# EAGLE design 224_distance (EAGLE 9.6.2)
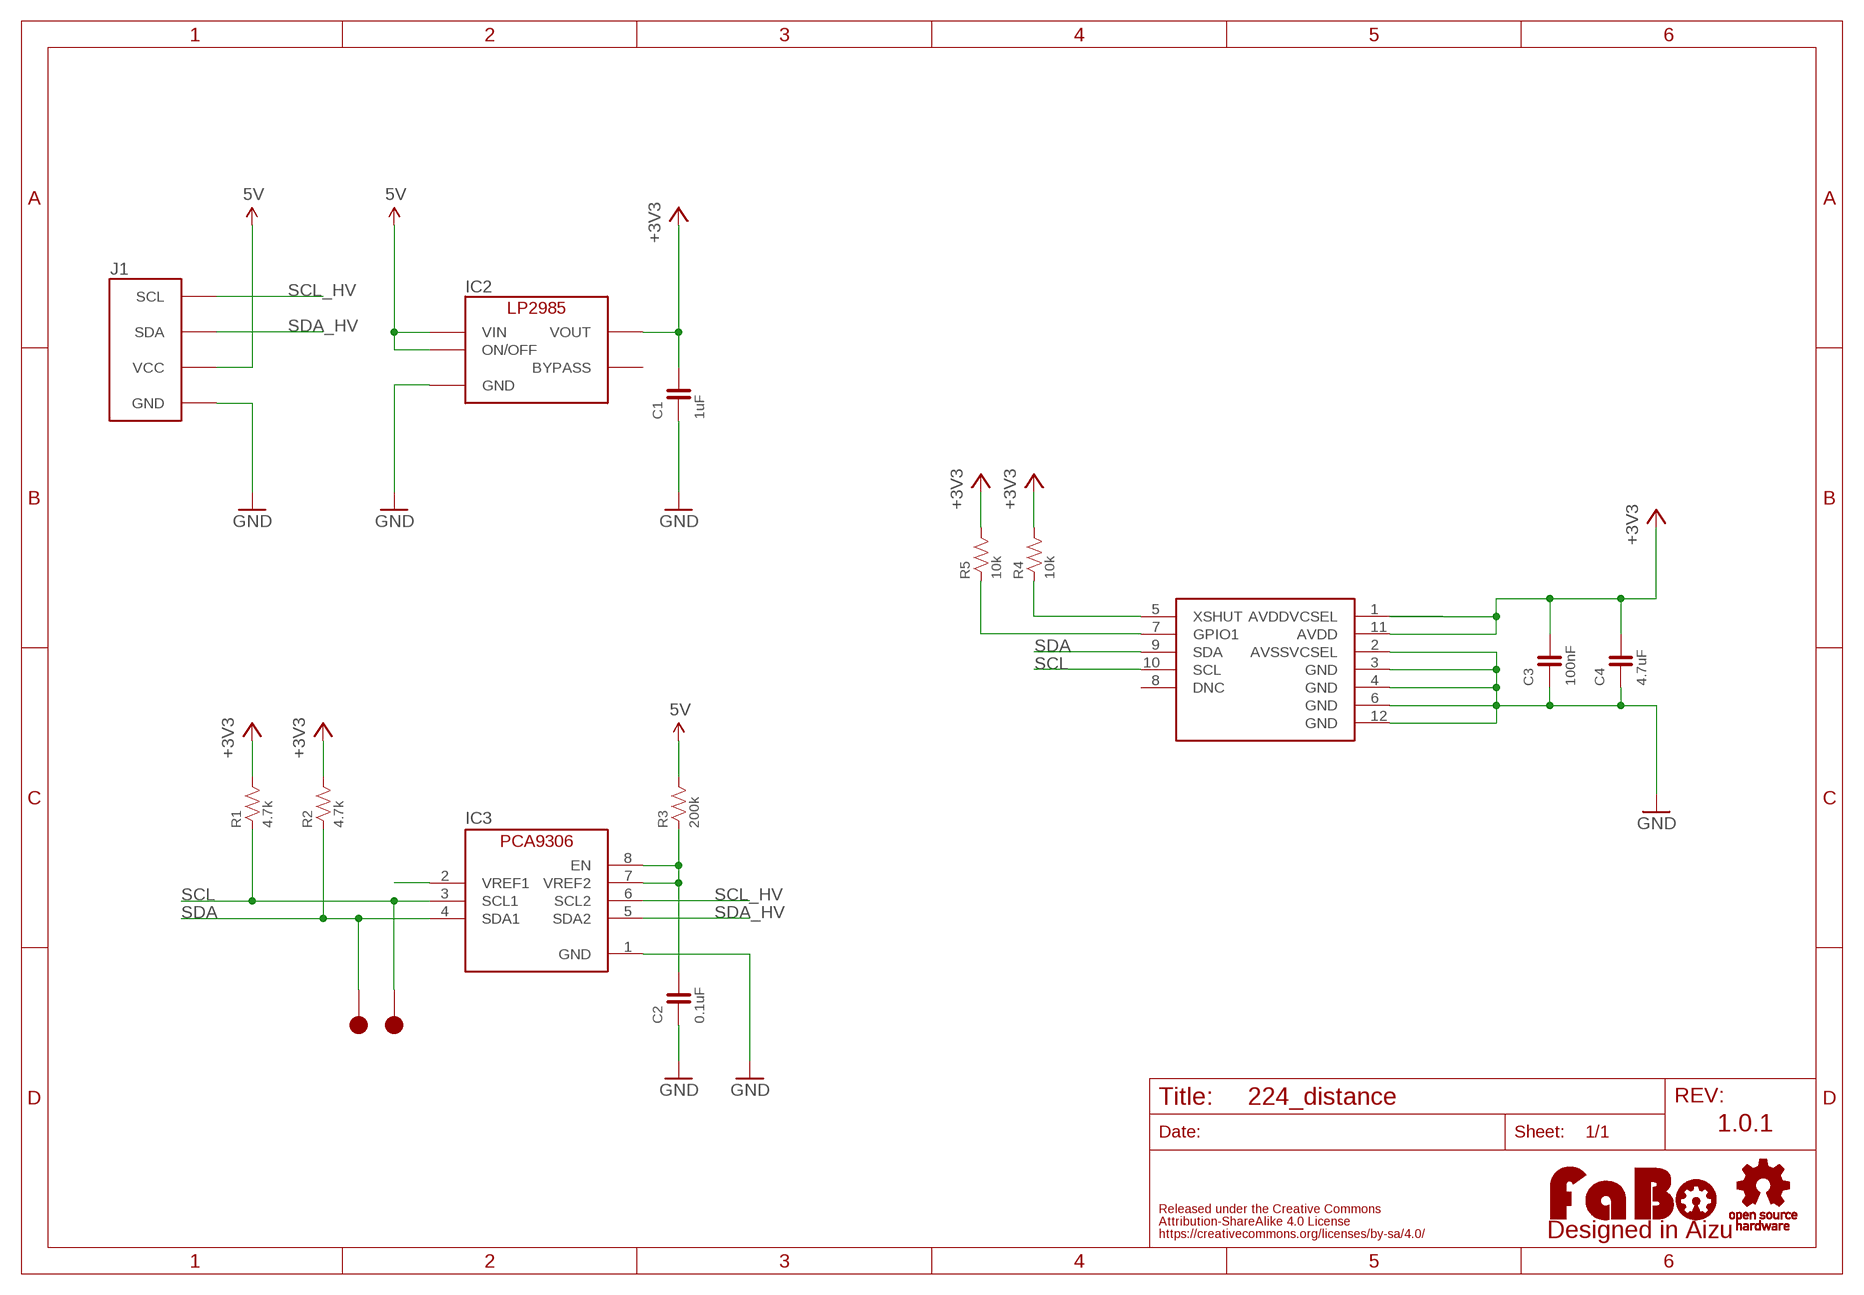
[diagram p0: schematic, sheet 1]

## Parts
C1  1uF  CAPACITOR-0603  [0603]
C2  0.1uF  CAPACITOR-0603  [0603]
C3  100nF  CAPACITOR-0603  [0603]
C4  4.7uF  CAPACITOR-0603  [0603]
IC2  LP2985-33DBV  [SOT-23-5]
IC3  PCA9306GM  [XQFN8]
J1  FABO_BRICK_I2C  [FABO_BRICK_I2C]
LOGO1  LOGO_FABO-M  [LOGO_FABO_M]
R1  4.7k  RESISTOR-0603  [0603]
R2  4.7k  RESISTOR-0603  [0603]
R3  200k  RESISTOR-0603  [0603]
R4  10k  RESISTOR-0603  [0603]
R5  10k  RESISTOR-0603  [0603]
TP1  TP-15  [TP-15]
TP2  TP-15  [TP-15]
U$2  LOGO_OSHW-M_BOTTOM  [LOGO_OSHW_M_BOTTOM]
VL1  ST-VL53L0XVL53  [ST-VL53L0X]

## Nets
5V: IC2.1(VIN) IC2.3(ON/OFF) J1.VCC R3.2
+3V3: C1.2 C3.2 C4.2 IC2.5(VOUT) R1.2 R2.2 R4.2 R5.2 VL1.1(AVDDVCSEL) VL1.11(AVDD)
GND: C1.1 C2.1 C3.1 C4.1 IC2.2(GND) IC3.1(GND) J1.GND VL1.2(AVSSVCSEL) VL1.3(GND) VL1.4(GND) VL1.6(GND) VL1.12(GND)
N$1: C2.2 IC3.7(VREF2) IC3.8(EN) R3.1
N$3: IC3.2(VREF1)
N$5: R4.1 VL1.5(XSHUT)
N$6: R5.1 VL1.7(GPIO1)
SCL: IC3.3(SCL1) R1.1 TP2.1 VL1.10(SCL)
SCL_HV: IC3.6(SCL2) J1.SCL
SDA: IC3.4(SDA1) R2.1 TP1.1 VL1.9(SDA)
SDA_HV: IC3.5(SDA2) J1.SDA
Unconnected: IC2.4(BYPASS) VL1.8(DNC)

## Notes on the sheet
- 1.0.1

## Library data of the parts
C1-C4 = FaBo-Capacitor:CAPACITOR: CAPACITOR
IC2 = FaBo-Supply:LP2985: LP2985
IC3 = FaBo-LevelTranslator:PCA9306
J1 = FaBo-Template:FABO_BRICK_I2C: FaBo Brick I2C
LOGO1 = component:LOGO_FABO
R1-R5 = FaBo-Resistors:RESISTOR: RESISTOR
TP1 TP2 = FaBo-Supply:TP
U$2 = FaBo-etc:LOGO_OSHW
VL1 = FaBo-Mems:ST-VL53L0X

## Board
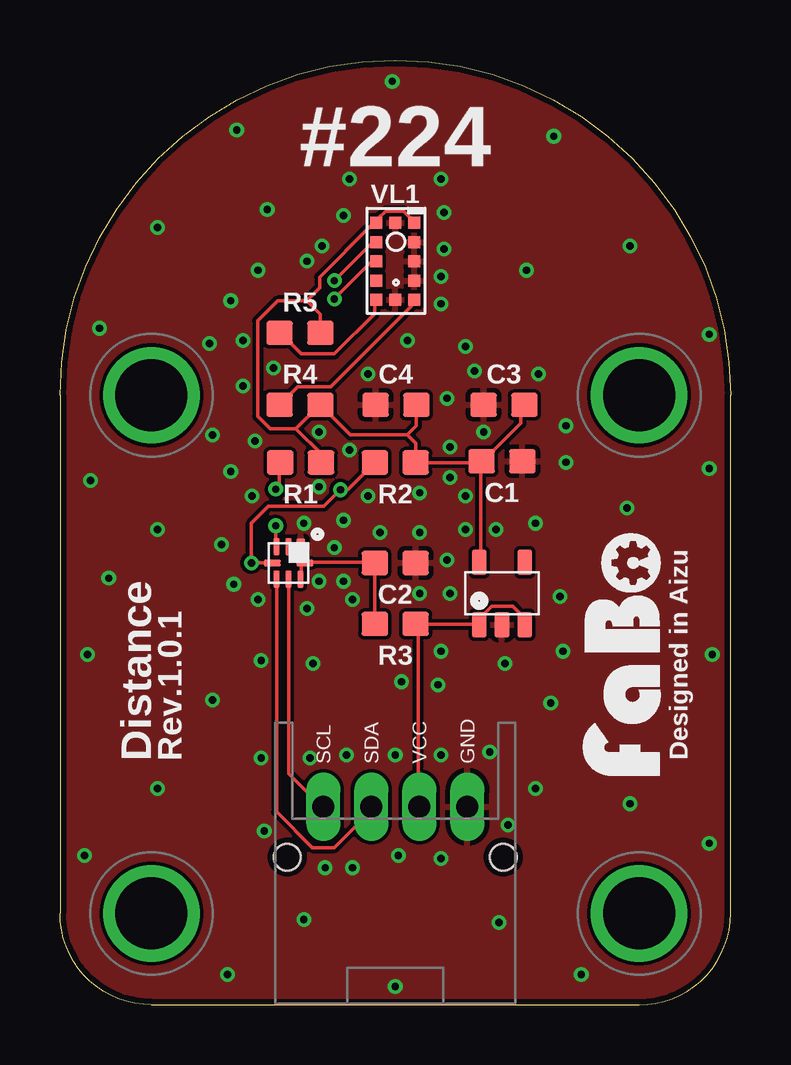
[diagram p1: board, top side]
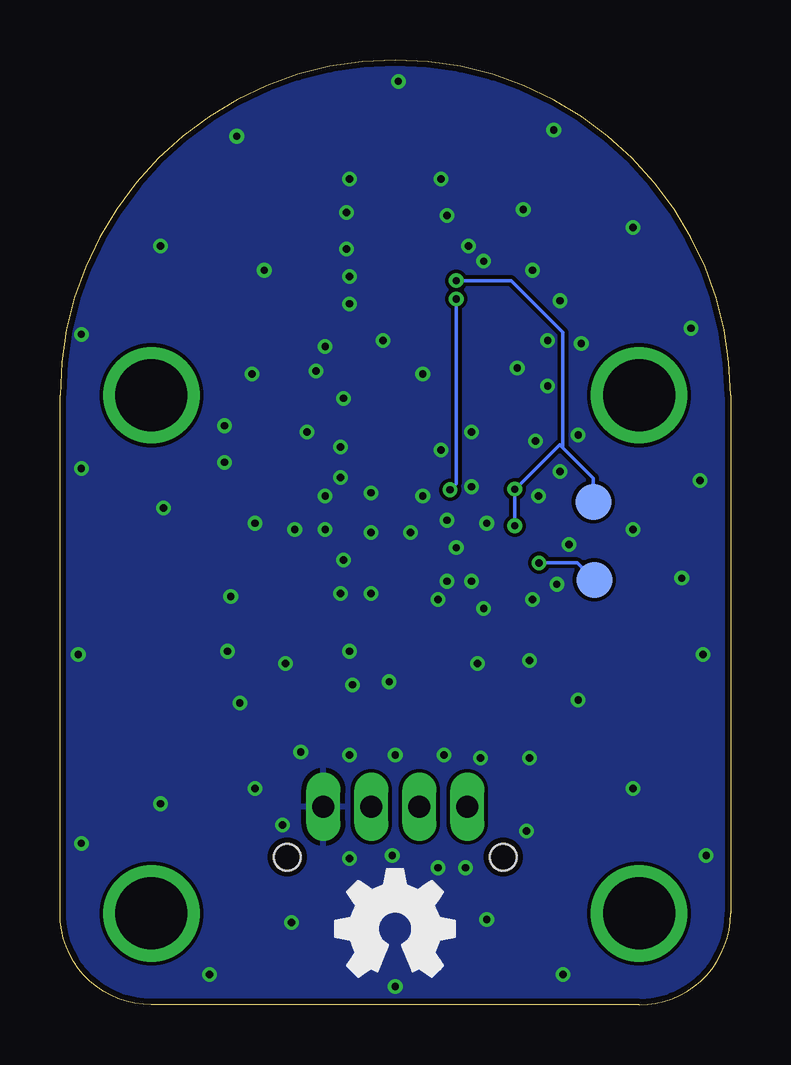
[diagram p2: board, bottom side, seen from below]

Size 27.94 x 39.37 mm. Coordinates in mm from the lower left corner, seen from the top.
Copper layers (1*16): Top 0.035mm / dielectric 1.6mm / Bottom 0.035mm
Design rules "PCBway": minimum track width 6mil, minimum drill 12mil, track to track 6mil, track to pad 6mil, pad to pad 6mil, via to via 6mil, smd to smd 6mil, copper to edge 10mil, drill to drill 10mil, minimum pad ring 10mil, minimum via ring 6mil, stop-mask expansion 2mil, vias tented up to drill 100mil, thermal gap 8mil

### Footprints (pad centres in the part's own frame; a part is rotated, then mirrored left to right if it is on the bottom)
0603 = smd 1.1 x 1: 1 -0.85,0; 2 0.85,0
SOT-23-5 = smd 0.6 x 1.05: 1 -0.95,-1.3; 2 0,-1.3; 3 0.95,-1.3; 4 0.95,1.3; 5 -0.95,1.3
XQFN8 = smd 0.7 x 0.35: 1 -0.675,0.5 | smd 0.7 x 0.25: 2 -0.675,0; 3 -0.675,-0.5; 5 0.675,-0.5; 6 0.675,0; 7 0.675,0.5 | smd 0.25 x 0.7: 4 0,-0.675; 8 0,0.675
FABO_BRICK_I2C = drill 0.9 pad 1.422 long: GND 3,-10.795; SCL -3,-10.795; SDA -1,-10.795; VCC 1,-10.795 | drill 3 pad 3.81: P$1 -10.16,6.35; P$2 10.16,6.35; P$3 -10.16,-15.24; P$4 10.16,-15.24 | hole 1.1: -4.5,-12.895; 4.5,-12.895
TP-15 = smd 1.5 x 1.5: 1 0,0
ST-VL53L0X = smd 0.5 x 0.5: 1 0.77,1.58; 2 0.77,0.78; 3 0.77,-0.02; 4 0.77,-0.82; 5 0.77,-1.62; 6 -0.03,-1.62; 7 -0.83,-1.62; 8 -0.83,-0.82; 9 -0.83,-0.02; 10 -0.83,0.78; 11 -0.83,1.58; 12 -0.03,1.58

### Placement (x,y rotation side)
C1  18.41,22.66 180 top
C2  13.97,18.41 180 top
C3  18.5,25 0 top
C4  14,25 0 top
IC2  18.41,17.14 0 top
IC3  9.53,18.41 270 top
J1  13.97,19.05 0 top
LOGO1  25.4,14.61 90 top
R1  10.03,22.59 0 top
R2  13.97,22.59 0 top
R3  13.97,15.88 0 top
R4  10,25 0 top
R5  10,28 0 top
TP1  5.67,17.7 0 bottom
TP2  5.71,20.95 0 bottom
U$2  13.97,3.17 0 top
VL1  14,31 0 top

### Tracks (layer width: path | path; a pad name or v marks a point on that pad's centre or on a via)
5V
  Top 0.152: 15.11,15.85 14.94,15.85 14.94,8.29 J1.VCC | 15.11,15.85 17.22,15.85 | 17.22,15.85 17.98,16.61 18.87,16.61 19.3,16.18 19.3,15.9 IC2.3 | IC2.1 17.22,15.85 | R3.2 15.09,15.88 15.11,15.85
+3V3
  Top 0.152: IC2.5 17.46,18.53 17.53,18.59 17.53,22.55 17.46,22.55 C1.2 | VL1.1 14.68,32.67 14.68,32.72 14.33,33.07 13.56,33.07 13.26,32.77 13.26,32.61 13.2,32.61 VL1.11 13.17,32.52 13.11,32.46 12.95,32.46 10.82,30.33 10.82,29.87 10.29,29.34 | C3.2 19.2,24.99 19.2,24.23 17.68,22.71 17.62,22.71 C1.2 | C1.2 17.5,22.59 R2.2 14.82,23.41 14.48,23.75 | 9.83,24 8.76,24 8.23,24.54 8.23,28.5 9.07,29.34 10.29,29.34 | 9.83,24 10.82,24.99 R4.2 12.1,23.75 14.48,23.75 | C4.2 14.85,24.12 14.48,23.75 | R1.2 10.88,22.96 9.83,24 | R5.2 10.85,28.77 10.29,29.34
GND  (via drill 0.3)
  other vias: 16.26,21.97 16.26,23.24 17.65,23.88 16.89,21.21 16.89,19.81 18.16,19.81 16.13,18.54 10.16,20.07 12.83,21.21 11.81,20.19 14.99,21.34 13.34,19.68 14.99,19.68 14.99,17.14 16.26,17.14 11.81,17.65 11.43,19.05 10.79,17.65 12.19,16.89 10.29,16.51 8.26,16.89 6.73,19.18 7.24,17.53 8,21.21 8.13,23.5 10.79,23.88 12.06,23.11 12.83,26.29 8.89,26.54 7.62,25.78 7.62,27.69 6.22,27.56 6.35,23.75 7.11,22.23 10.79,21.59 14.48,27.69 15.88,29.21 15.88,30.35 16,31.5 16,33.02 11.81,32.89 10.92,31.62 10.29,30.99 8.26,30.61 7.11,29.34 12.06,34.42 15.88,34.42 16.89,27.43 16.13,25.27 17.27,26.42 19.94,26.29 21.08,24.13 21.08,22.61 13.84,38.48 7.37,36.45 20.57,36.2 27.05,27.94 1.65,28.19 4.06,32.38 23.75,31.62 19.43,30.61 8.64,33.15 1.27,21.84 27.05,22.35 14.22,13.46 15.75,13.34 15.88,14.73 18.54,14.22 20.83,17.02 19.81,20.07 10.41,10.29 8.38,10.29 8.38,14.35 10.54,14.22 1.02,6.22 27.05,6.73 21.72,1.27 6.99,1.27 8.51,7.24 11.05,5.71 12.19,5.71 14.1,6.22 15.88,6.1 18.67,7.49 17.91,10.54 15.88,10.41 13.97,10.41 11.94,10.41 19.81,9.02 27.18,14.61 1.14,14.61 4.06,19.81 4.06,9.02 6.35,12.7 20.45,12.57 23.75,8.38 23.62,20.7 20.95,14.73 10.16,3.56 13.97,0.76 18.29,3.43 2.03,17.78
  pour Bottom: 0,0 27.94,0 27.94,39.37 0,39.37
  pour Top: 0,0 27.94,0 27.94,39.37 0,39.37
N$1
  Top 0.152: R3.1 13.11,15.89 13.11,18.29 13.12,18.3 C2.2 13.11,18.43 13.11,18.44 10.21,18.44 10.2,18.43 IC3.8 10.06,18.41 10.06,17.83 10.03,17.8 IC3.7
N$5
  Top 0.152: VL1.5 14.65,29.26 14.63,29.26 14.63,29.11 11.28,25.76 9.91,25.76 R4.1 | R4.1
N$6
  Top 0.152: VL1.7 13.11,29.32 13.11,28.8 11.43,27.13 10.06,27.13 9.19,28 R5.1
SCL  (via drill 0.3)
  Top 0.152: v11.43,30.18 12.95,31.7 13.11,31.7 13.17,31.76 VL1.10 | v8.99,19.96 8.99,19.12 IC3.3 | v8.99,21.49 9.14,21.64 9.14,22.55 R1.1
  Bottom 0.152: v11.43,30.18 9.14,30.18 6.99,28.02 6.99,23.22 | v8.99,19.96 8.99,21.46 | 8.99,21.46 v8.99,21.49 | 8.99,21.46 7.11,23.34 6.99,23.22 | TP2.1 5.71,21.95 6.99,23.22
SCL_HV
  Top 0.152: IC3.6 9.53,9.63 10.9,8.26 J1.SCL
SDA  (via drill 0.3)
  Top 0.152: v11.43,29.41 12.95,30.94 13.13,30.94 VL1.9 | R2.1 11.99,21.46 v11.68,21.46 11,20.78 8.69,20.78 7.98,20.07 v7.98,18.41 IC3.4
  Bottom 0.152: v11.68,21.46 11.43,21.72 v11.43,29.41 | TP1.1 6.38,18.41 v7.98,18.41
SDA_HV
  Top 0.152: J1.SDA 12.97,8.09 11.43,6.55 10.52,6.55 9.03,8.04 IC3.5

### Text on the board
tPlace: #224 | Designed in Aizu | Distance | Rev.1.0.1